# EAGLE design servo_board (EAGLE 5.06)
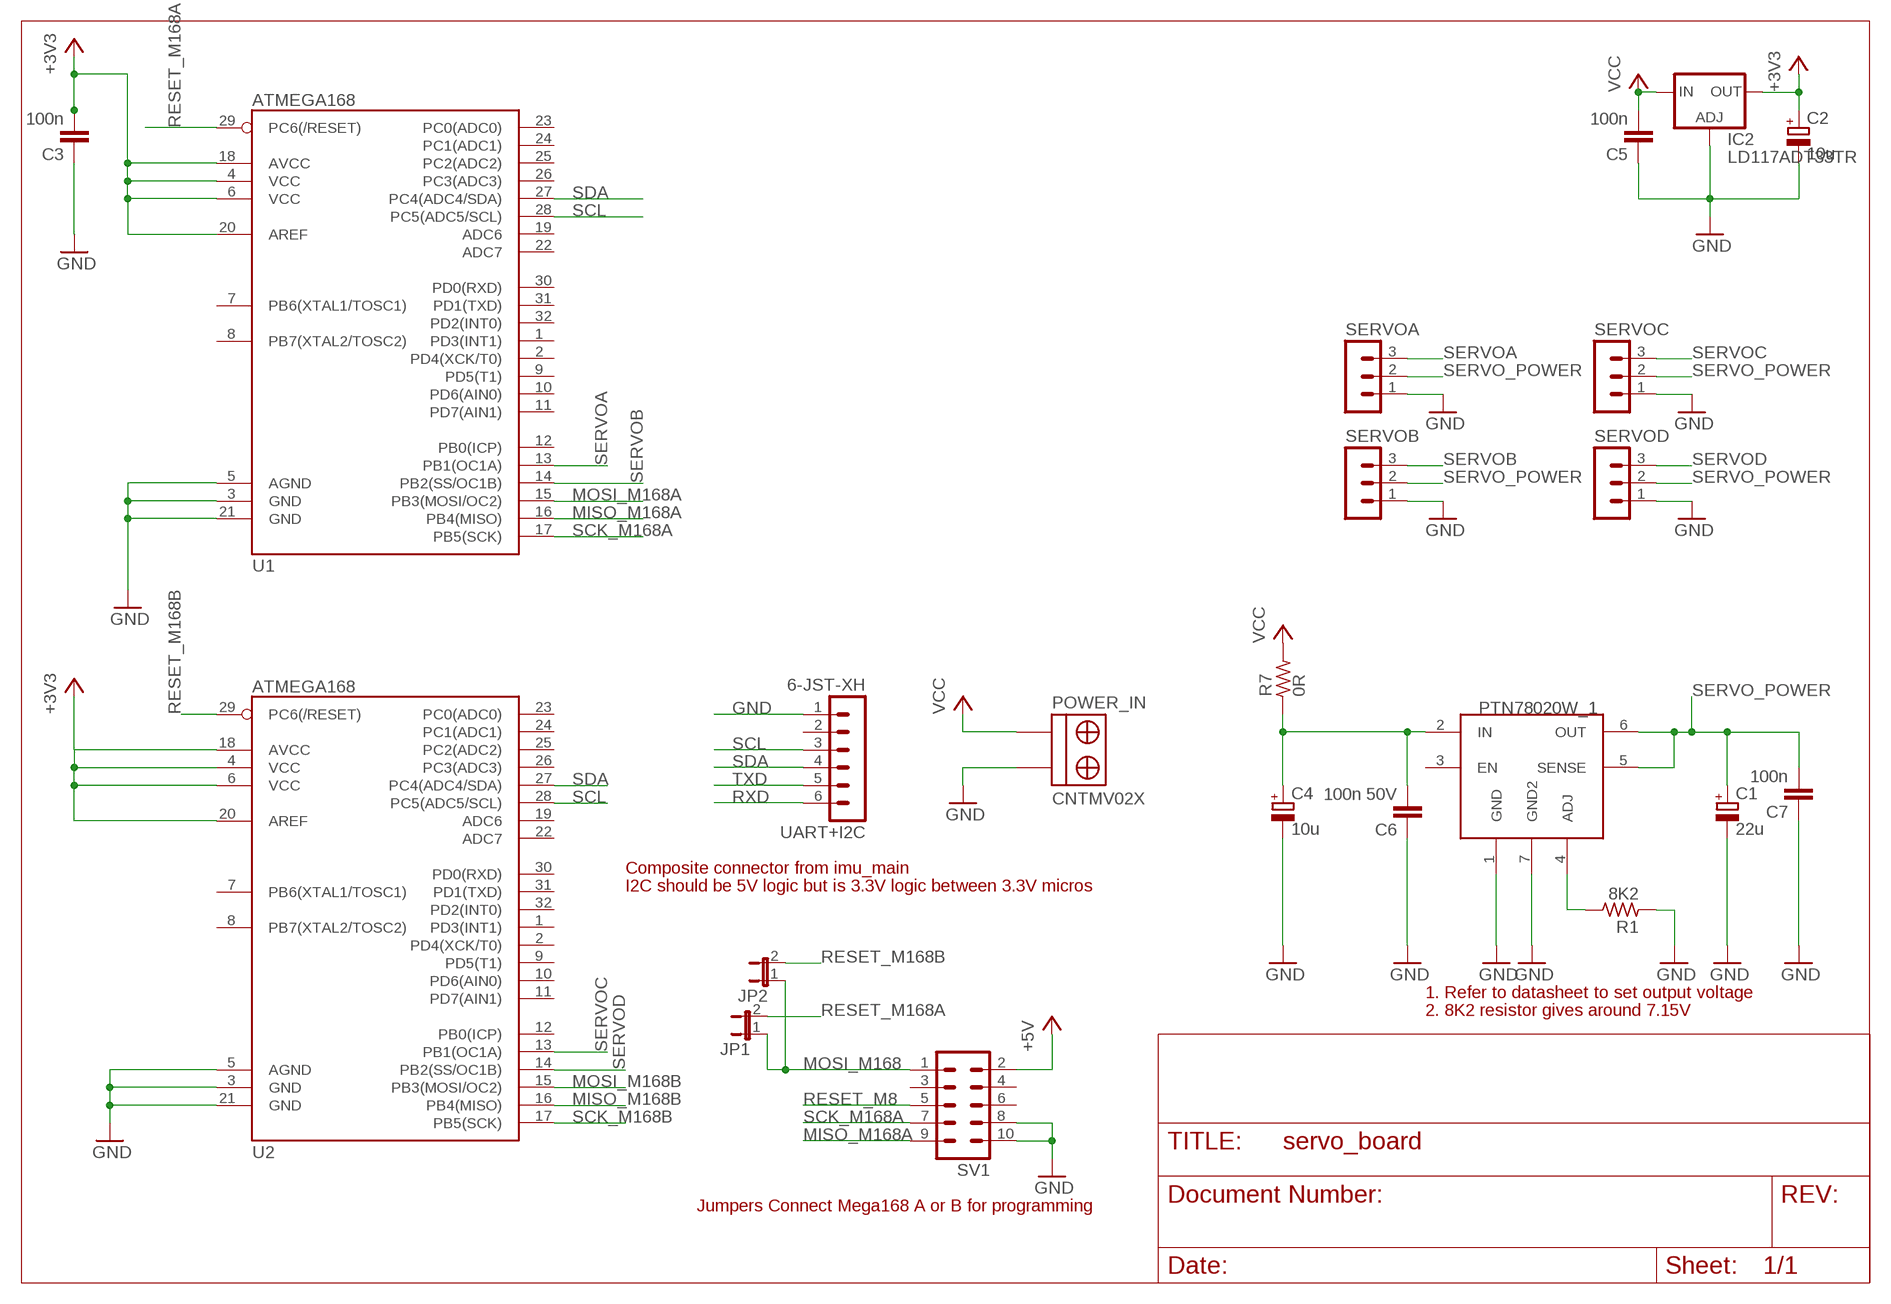
[diagram p0: schematic, sheet 1]

## Parts
C1  22u  CPOL-EUC/6032-28R  [C/6032-28R]
C2  10u  CPOL-EUC/6032-28R  [C/6032-28R]
C3  100n  C-EUC0805  [C0805]
C4  10u  CPOL-EUC/6032-28R  [C/6032-28R]
C5  100n  C-EUC0805  [C0805]
C6  100n 50V  C-EUC3216  [C3216]
C7  100n  C-EUC3216  [C3216]
IC2  LD117ADT33TR  [DPACK]
JP1  JP1E  [JP1]
JP2  JP1E  [JP1]
POWER_IN  CNTMV02X  [CNTMV02X]
PTN78020W_1  PTN78020  [PTN78020]
R1  8K2  R_2012  [R2012]
R7  0R  R_2512  [R2512]
SERVOA  MA03-1  [MA03-1]
SERVOB  MA03-1  [MA03-1]
SERVOC  MA03-1  [MA03-1]
SERVOD  MA03-1  [MA03-1]
SV1  MA05-2LARGE_PAD  [MA05-2A]
U1  ATMEGA168  [TQFP32-08]
U2  ATMEGA168  [TQFP32-08]
UART+I2C  6-JST-XH  [6]

## Nets
+3V3: C2.+ C3.2 IC2.4(OUT) U1.4(VCC) U1.6(VCC) U1.18(AVCC) U1.20(AREF) U2.4(VCC) U2.6(VCC) U2.18(AVCC) U2.20(AREF)
+5V: SV1.2
GND: C1.- C2.- C3.1 C4.- C5.1 C6.1 C7.1 IC2.1(ADJ) POWER_IN.1(+) PTN78020W_1.1(GND) PTN78020W_1.7(GND2) R1.1 SERVOA.1 SERVOB.1 SERVOC.1 SERVOD.1 SV1.8 SV1.10 U1.3(GND) U1.5(AGND) U1.21(GND) U2.3(GND) U2.5(AGND) U2.21(GND) UART+I2C.1
MISO_M168A: SV1.9 U1.16(PB4(MISO))
MISO_M168B: U2.16(PB4(MISO))
MOSI_M168: JP1.1 JP2.1 SV1.1
MOSI_M168A: U1.15(PB3(MOSI/OC2))
MOSI_M168B: U2.15(PB3(MOSI/OC2))
N$10: PTN78020W_1.4(ADJ) R1.2
N$11: C4.+ C6.2 PTN78020W_1.2(IN) R7.1
RESET_M8: SV1.5
RESET_M168A: JP1.2 U1.29(PC6(/RESET))
RESET_M168B: JP2.2 U2.29(PC6(/RESET))
RXD: UART+I2C.6
SCK_M168A: SV1.7 U1.17(PB5(SCK))
SCK_M168B: U2.17(PB5(SCK))
SCL: U1.28(PC5(ADC5/SCL)) U2.28(PC5(ADC5/SCL)) UART+I2C.3
SDA: U1.27(PC4(ADC4/SDA)) U2.27(PC4(ADC4/SDA)) UART+I2C.4
SERVO_POWER: C1.+ C7.2 PTN78020W_1.5(SENSE) PTN78020W_1.6(OUT) SERVOA.2 SERVOB.2 SERVOC.2 SERVOD.2
SERVOA: SERVOA.3 U1.13(PB1(OC1A))
SERVOB: SERVOB.3 U1.14(PB2(SS/OC1B))
SERVOC: SERVOC.3 U2.13(PB1(OC1A))
SERVOD: SERVOD.3 U2.14(PB2(SS/OC1B))
TXD: UART+I2C.5
VCC: C5.2 IC2.3(IN) POWER_IN.2(-) R7.2
Unconnected: PTN78020W_1.3(EN) SV1.3 SV1.4 SV1.6 U1.1(PD3(INT1)) U1.2(PD4(XCK/T0)) U1.7(PB6(XTAL1/TOSC1)) U1.8(PB7(XTAL2/TOSC2)) U1.9(PD5(T1)) U1.10(PD6(AIN0)) U1.11(PD7(AIN1)) U1.12(PB0(ICP)) U1.19(ADC6) U1.22(ADC7) U1.23(PC0(ADC0)) U1.24(PC1(ADC1)) U1.25(PC2(ADC2)) U1.26(PC3(ADC3)) U1.30(PD0(RXD)) U1.31(PD1(TXD)) U1.32(PD2(INT0)) U2.1(PD3(INT1)) U2.2(PD4(XCK/T0)) U2.7(PB6(XTAL1/TOSC1)) U2.8(PB7(XTAL2/TOSC2)) U2.9(PD5(T1)) U2.10(PD6(AIN0)) U2.11(PD7(AIN1)) U2.12(PB0(ICP)) U2.19(ADC6) U2.22(ADC7) U2.23(PC0(ADC0)) U2.24(PC1(ADC1)) U2.25(PC2(ADC2)) U2.26(PC3(ADC3)) U2.30(PD0(RXD)) U2.31(PD1(TXD)) U2.32(PD2(INT0)) UART+I2C.2

## Notes on the sheet
- Composite connector from imu_main
- I2C should be 5V logic but is 3.3V logic between 3.3V micros
- 1. Refer to datasheet to set output voltage
- 2. 8K2 resistor gives around 7.15V
- Jumpers Connect Mega168 A or B for programming

## Library data of the parts
C1 C2 C4 = rcl:CPOL-EU: POLARIZED CAPACITOR, European symbol
C3 C5-C7 = rcl:C-EU: CAPACITOR, European symbol
IC2 = v-reg:LD117A?*: Low drop fixed and adjustable positive voltage regulators 1 A Source: http://www.st.com/stonline/products/literature/ds/7194/ld1117axx.pdf
JP1 JP2 = jumper:JP1E: JUMPER
POWER_IN = robert-custom:CNTMV02X
PTN78020W_1 = robert-custom:PTN78020
R1 R7 = rc-master-smd:R_: RESISTOR
SERVOA SERVOB SERVOC SERVOD = con-lstb:MA03-1: PIN HEADER
SV1 = con-lstb:MA05-2: PIN HEADER
U1 U2 = SparkFun:ATMEGA168
UART+I2C = con-jst-xh:6-JST-XH

## Board
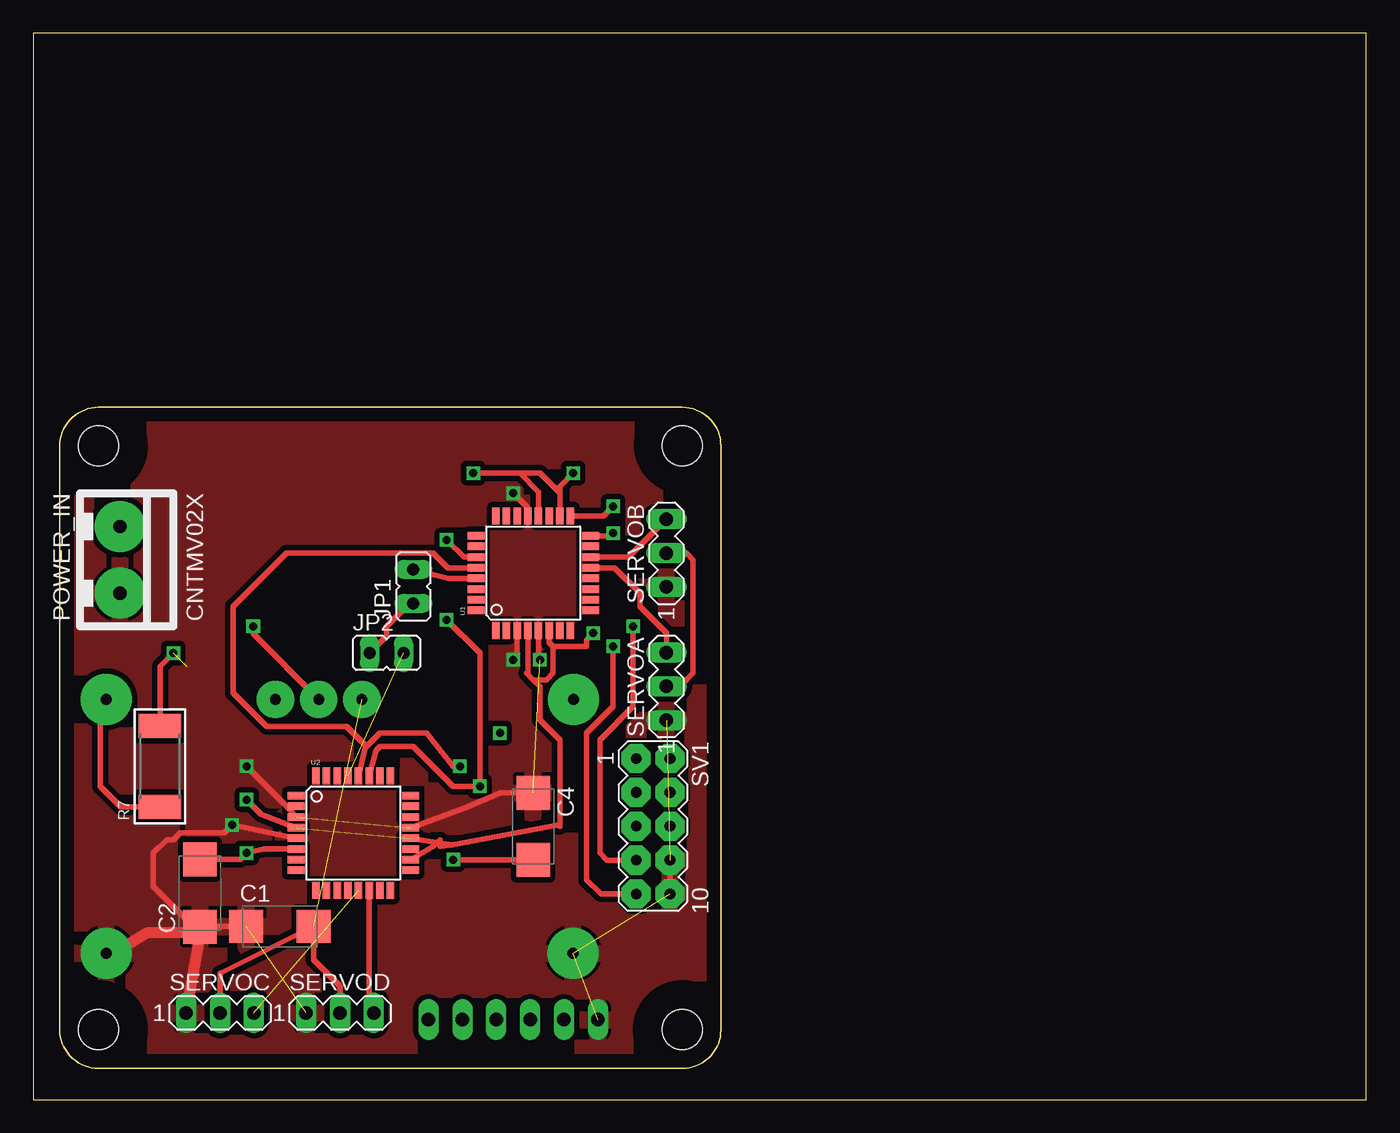
[diagram p1: board, top side]
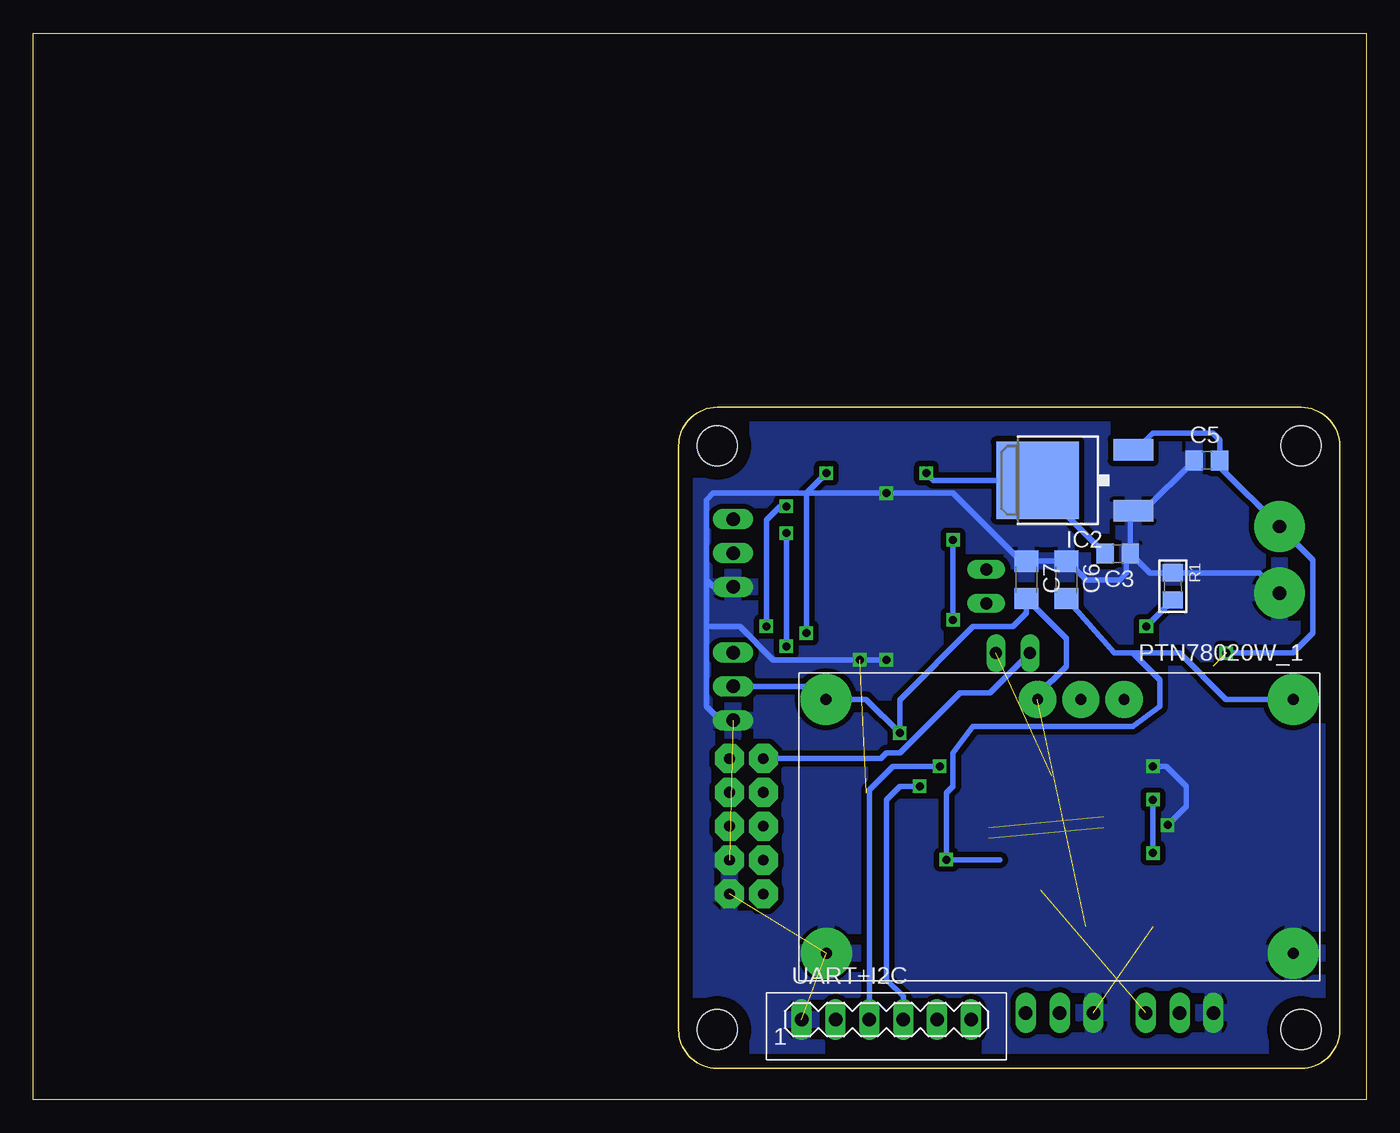
[diagram p2: board, bottom side, seen from below]

Size 100 x 80 mm. Coordinates in mm from the lower left corner, seen from the top.
Outline: 0,0 100,0 100,80 0,80 0,0
Outline: 1.99,5.24 1.99,49.04 arc-90 4.89,51.94 48.69,51.94 arc-90 51.59,49.04 51.59,5.24 arc-90 48.69,2.34 4.89,2.34 arc-90 1.99,5.24
Copper layers (1*16): Top 0.035mm / dielectric 1.5mm / Bottom 0.035mm
Design rules "default": minimum track width 10mil, minimum drill 24mil, track to track 8mil, track to pad 8mil, pad to pad 8mil, via to via 8mil, smd to smd 8mil, copper to edge 40mil, drill to drill 8mil, minimum pad ring 10mil, minimum via ring 8mil, stop-mask expansion 4mil, vias tented up to drill 0mil, thermal gap 10mil
Holes 3 mm at 4.89,49.04 48.69,49.04 4.89,5.24 48.69,5.24
tRestrict: area 1.8,45.9 to 8,52.1; area 45.7,46 to 51.9,52.2; area 45.6,2.1 to 51.8,8.3; area 1.8,2.1 to 8,8.3

### Footprints (pad centres in the part's own frame; a part is rotated, then mirrored left to right if it is on the bottom)
C/6032-28R = smd 2.55 x 2.5: + 2.525,0; - -2.525,0
C0805 = smd 1.3 x 1.5: 1 -0.95,0; 2 0.95,0
C3216 = smd 1.6 x 1.8: 1 -1.4,0; 2 1.4,0
DPACK = smd 1.6 x 3: 1 -2.28,-4.8; 3 2.28,-4.8 | smd 5.8 x 6.2: 4 0,2.38
JP1 = drill 0.914 long: 1 0,-1.27; 2 0,1.27
CNTMV02X = drill 1 pad 3.81 round: 1 2.5,0; 2 -2.5,0
PTN78020 = drill 0.8 pad 3.81 round: 1 -17.526,9.525; 2 -17.526,-9.525; 6 17.531,-9.525; 7 17.499,9.525 | drill 0.8 pad 2.794 round: 3 -4.831,-9.525; 4 -1.587,-9.525; 5 1.656,-9.525
R2012 = smd 1.3 x 1.5: 1 -1.016,0; 2 1.016,0
R2512 = smd 1.8 x 3.2: 1 -3.048,0; 2 3.048,0
MA03-1 = drill 1.016 long: 1 -2.54,0; 2 0,0; 3 2.54,0
MA05-2A = drill 0.8 pad 2.184 octagon: 1 -5.08,-1.27; 2 -5.08,1.27; 3 -2.54,-1.27; 4 -2.54,1.27; 5 0,-1.27; 6 0,1.27; 7 2.54,-1.27; 8 2.54,1.27; 9 5.08,-1.27; 10 5.08,1.27
TQFP32-08 = smd 1.27 x 0.559: 1 -4.293,2.8; 2 -4.293,2; 3 -4.293,1.2; 4 -4.293,0.4; 5 -4.293,-0.4; 6 -4.293,-1.2; 7 -4.293,-2; 8 -4.293,-2.8; 17 4.293,-2.8; 18 4.293,-2; 19 4.293,-1.2; 20 4.293,-0.4; 21 4.293,0.4; 22 4.293,1.2; 23 4.293,2; 24 4.293,2.8 | smd 0.559 x 1.27: 9 -2.8,-4.293; 10 -2,-4.293; 11 -1.2,-4.293; 12 -0.4,-4.293; 13 0.4,-4.293; 14 1.2,-4.293; 15 2,-4.293; 16 2.8,-4.293; 25 2.8,4.293; 26 2,4.293; 27 1.2,4.293; 28 0.4,4.293; 29 -0.4,4.293; 30 -1.2,4.293; 31 -2,4.293; 32 -2.8,4.293
6 = drill 1.016 long: 1 -6.35,0; 2 -3.81,0; 3 -1.27,0; 4 1.27,0; 5 3.81,0; 6 6.35,0

### Placement (x,y rotation side)
C1  18.5,13 0 top
C2  12.5,15.5 90 top
C3  18.64,40.96 180 bottom
C4  37.5,20.5 270 top
C5  11.96,47.95 0 bottom
C6  22.5,39 270 bottom
C7  25.5,39 270 bottom
IC2  22.28,46.46 90 bottom
JP1  28.5,38.5 0 top
JP2  26.5,33.5 270 top
POWER_IN  6.5,40.5 270 top
PTN78020W_1  23,20.5 180 bottom
R1  14.5,38.5 270 bottom
R7  9.5,25 90 top
SERVOA  47.5,31 90 top
SERVOB  47.5,41 90 top
SERVOC  14,6.5 0 top
SERVOD  23,6.5 0 top
SV1  46.5,20.5 270 top
U1  37.5,39.5 90 top
U2  24,20 0 top
UART+I2C  36,6 0 bottom

### Tracks (layer width: path | path; a pad name or v marks a point on that pad's centre or on a via)
+3V3  (via drill 0.6)  (1 unrouted)
  Top 0.406: 36.5,47 v33,47 | 36.5,47 38,47 39.5,45.5 U1.18 39.5,46 v40.5,47 | U1.20 37.9,45.6 36.5,47 | 39,34 39,32 38.5,31.5 37.5,31.5 | 37.5,31.5 37,32 37.1,32.1 U1.4 | 31.4,19.1 U2.20 | 31.4,19.1 30.5,19 30.5,19.5 30,19 U2.18 | 31.4,19.1 39.4,20.6 39.5,20.5 39.5,27 38,28.5 38,31 37.5,31.5 | U1.6 38.7,34.3 39,34 | 39,34 41.5,34 41.5,34.5 v42,35 | C2.+ 15.53,18.02 v16,18.5 17.3,18.8 U2.6 | U2.4 17.1,21.4 v16,22.5
  Bottom 0.406: IC2.4 24.62,46.5 24.5,46.5 | C3.2 24.66,46.03 IC2.4 | IC2.4 32.46,46.46 v33,47 | v42,35 42,45.5 v40.5,47 | v16,18.5 v16,22.5
GND  (via drill 0.6)  (6 unrouted)
  Top 0.406: 12.54,12.48 C2.- 12.53,13 C1.- 12,13 9,16 9,18.5 10,19.5 10.5,19.5 11,20 14.3,20 v14.9,20.6 U2.5 | U2.3 18.8,22.2 v16,25 | U1.5 37.9,33.1 v38,33 | U1.3 36.3,33.3 v36,33 | U2.21 32.4,21.9 35,23 37.48,23 C4.- | SV1.10 SV1.8 | U1.21 37.1,44.4 v36,45.5
  Top 0.813: SERVOC.1 12.54,12.48 | PTN78020W_1.1 5.97,10.97 8.5,12.5 12.03,12.5 C2.-
  Bottom 0.406: v16,25 15,25 13.5,23.5 13.5,22 v14.9,20.6 | C5.1 16.68,44.18 IC2.1 17.69,43.97 C3.1 | C3.1 16.25,39.52 R1.1 8.02,39.52 POWER_IN.1 | C3.1 18,40.65 18,39.5 18.5,39 21,39 21.9,39.9 C6.1 C7.1 25.9,40.4 31,45.5 v36,45.5 49,45.5 49.5,45 49.5,39.5 | 47.96,38.46 SERVOB.1 47.54,38.5 49,38.5 49.5,39 49.5,39.5 | v36,33 v38,33 44.5,33 47,35.5 49.5,35.5 | SERVOA.1 48.46,28.46 49.5,29.5 49.5,35.5 | 49.5,39.5 49.5,35.5
  pour Top (isolate 0.406): 2.5,3 51,3 51,51.5 2.5,51.5
  pour Bottom (isolate 0.406): 3,3 51,3 51,51.5 2.5,51.5 2.5,3
MISO_M168A  (via drill 0.6)
  Top 0.406: SV1.9 42.58,15.42 41.5,16.5 41.5,27.5 43.5,29.5 v43.5,34 | U1.16 43.3,42.3 v43.5,42.5
  Bottom 0.406: v43.5,34 v43.5,42.5
MOSI_M168
  Top 0.406: JP2.1 26.5,34.77 26.5,35.5 28.23,37.23 JP1.1
  Bottom 0.406: SV1.1 36.42,25.58 36,26 35,26 30.5,30.5 28.23,30.5 JP2.1
N$2  (via drill 0.6)
  other vias: 10.5,33.5
N$3  (via drill 0.6)
  other vias: 16.5,35.5
N$4  (via drill 0.6)
  other vias: 35,27.5
N$5  (via drill 0.6)
  other vias: 45,35.5
N$6  (via drill 0.6)
  other vias: 16,22.5
N$7  (via drill 0.6)
  other vias: 16,18.5
N$10  (via drill 0.6)
  Top 0.406: PTN78020W_1.4 16.48,34.95 v16.48,35.5
  Bottom 0.406: R1.2 v16.48,35.5 16.5,35.5
N$11  (via drill 0.6)
  Top 0.406: PTN78020W_1.2 5,29.55 5,23.5 6.55,21.95 R7.1 | C4.+ 31.52,17.98 v31.5,18
  Bottom 0.406: 18.9,33.5 C6.2 | 18.9,33.5 14,33.5 10.53,30.02 PTN78020W_1.2 | 18.9,33.5 17.5,33.5 15.5,31.5 15.5,29.5 17.5,28 29.5,28 31,26 31,23.5 31.5,23 v31.5,18 27.5,18
RESET_M168A
  Top 0.406: U1.29 31.17,39.1 JP1.2
RESET_M168B  (1 unrouted)
SCK_M168A  (via drill 0.6)  (1 unrouted)
  Top 0.406: SV1.7 43.04,17.96 42.5,18.5 42.5,27 45,29.5 45,35.5 | U1.17 42.79,43.79 v43.5,44.5
  Bottom 0.406: v43.5,44.5 44,44.5 45,43.5 45,35.5
SCL  (via drill 0.6)
  Top 0.406: U2.28 24.9,26.4 25,26.5 | 25,26.5 26,27.5 29.5,27.5 31.5,25 v32,25 | U1.28 31.1,39.9 30,41 19,41 15,37 15,30.5 17.5,28 23.5,28 25,26.5
  Bottom 0.406: UART+I2C.3 37.27,23.23 35.5,25 v32,25
SDA  (via drill 0.6)
  Top 0.406: U2.27 25.7,26.2 26,26.5 28.5,26.5 31.5,23.5 v33.5,23.5 33.5,33.5 v31,36 | U1.27 32.3,40.7 v31,42
  Bottom 0.406: UART+I2C.4 34.73,7.73 36,9 36,22.5 35,23.5 v33.5,23.5 | v31,36 v31,42
SERVO_POWER  (1 unrouted)
  Top 0.406: SERVOC.2 14,9.47 C1.+ 21.02,10.47 23,8.5 SERVOD.2 | SERVOB.2 49,41 49.5,40.5 49.5,32 48.5,31 SERVOA.2
  Bottom 0.406: SERVOA.2 41.51,31 PTN78020W_1.6 37.52,30.02 35,27.5 35,30 29.5,35.5 26.5,35.5 25.5,36.5 C7.2 22.5,34.6 22.5,32.5 24.66,30.34 PTN78020W_1.5
SERVOA
  Top 0.406: U1.13 43.6,39.9 45.5,38 45.5,37 47.5,35 SERVOA.3
SERVOB
  Top 0.406: U1.14 44.66,40.7 SERVOB.3
SERVOC  (1 unrouted)
SERVOD
  Top 0.406: U2.14 25.2,6.84 SERVOD.3
VCC  (2 unrouted)
  Top 0.406: R7.2 9.5,32.5 10.5,33.5
  Bottom 0.406: IC2.3 17.26,48.74 16,50 11.5,50 11,49.5 C5.2 11.01,47.51 POWER_IN.2 4,40.5 4,35 5.5,33.5 10.5,33.5